# Altium schematic sheet Pointer.SchDoc
size A
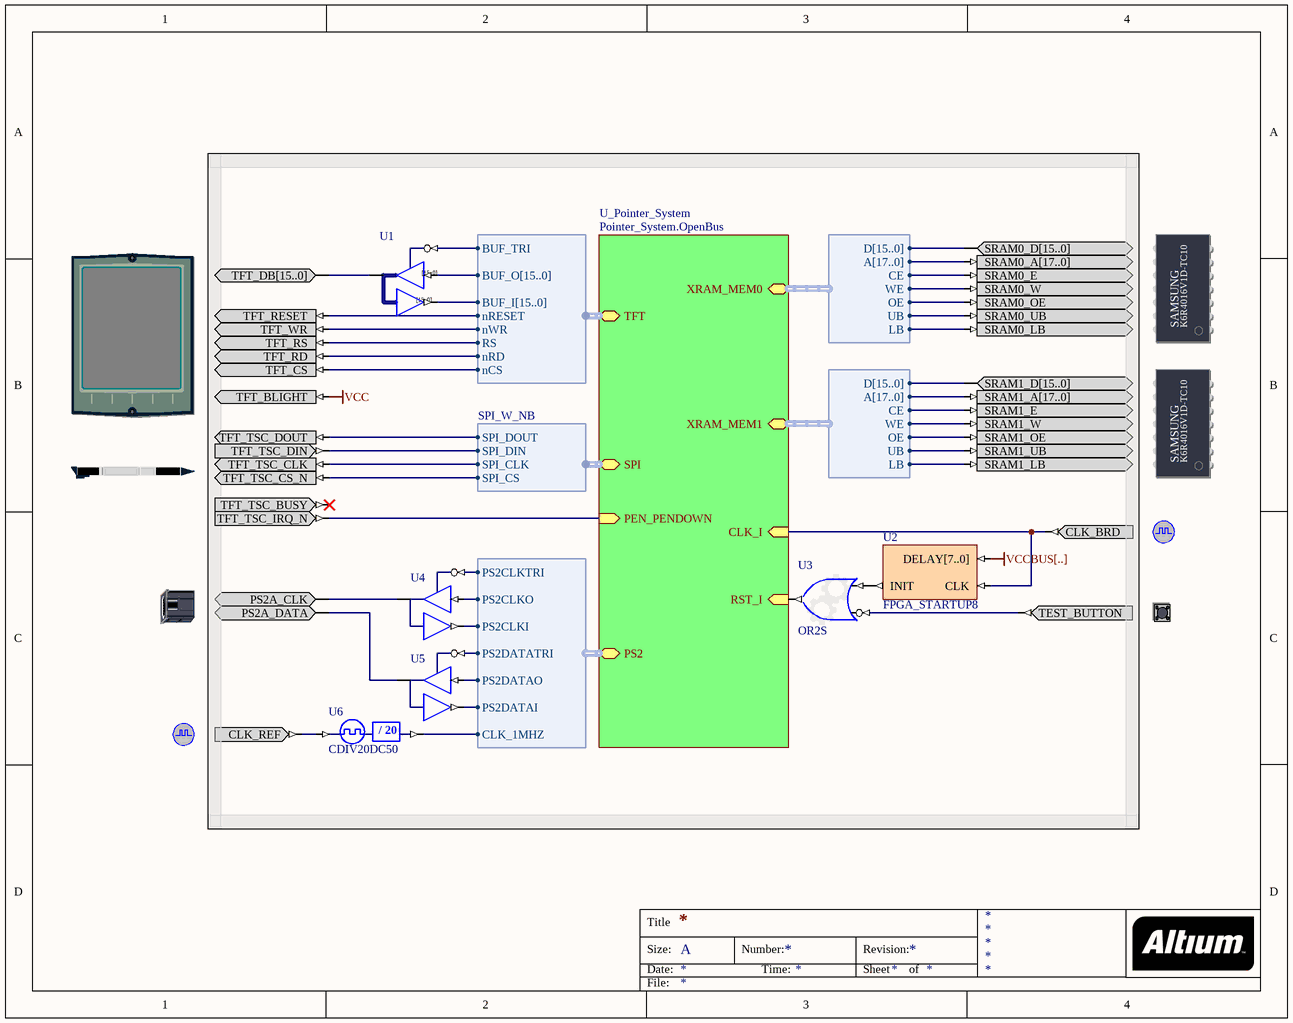
[diagram p0: Pointer.SchDoc]

## Parts
(Parts that share a designator on the sheet are numbered #1, #2 ... from top to bottom, then left to right.)
?#1  SRAM_DAUGHTER0  (value not drawn)
?#2  TFT_LCD  (value not drawn)
?#3  SRAM_DAUGHTER1  (value not drawn)
?#4  TOUCH_SCREEN_PEN  (value not drawn)
?#5  CLOCK_BOARD  (value not drawn)
?#6  PS2A  (value not drawn)
?#7  TEST_BUTTON  (value not drawn)
?#8  CLOCK_REFERENCE  (value not drawn)
U1  IOBUF16B  (value not drawn)
U2  FPGA_STARTUP8
U3  OR2S
U4  IOBUF  (value not drawn)
U5  IOBUF  (value not drawn)
U6  CDIV20DC50

## Sub-sheets
U_Pointer_System = Pointer_System.OpenBus: CLK_I (in), RST_I (in), PS2 (harness PS2_W), SPI (harness SPI_W_NB), PEN_PENDOWN (in), XRAM_MEM0 (harness WB_MEM_CTRL_SRAM16_A18), XRAM_MEM1 (harness WB_MEM_CTRL_SRAM16_A18), TFT (harness VGA32_ILI9320)

## Harnesses
WB_MEM_CTRL_SRAM16_A18: D[15..0], A[17..0], CE, WE, OE, UB, LB
PS2_W: PS2CLKTRI, PS2CLKO, PS2CLKI, PS2DATATRI, PS2DATAO, PS2DATAI, CLK_1MHZ
VGA32_ILI9320: BUF_TRI, BUF_O[15..0], BUF_I[15..0], nRESET, nWR, RS, nRD, nCS
SPI_W_NB: SPI_DOUT, SPI_DIN, SPI_CLK, SPI_CS

## Nets
VCC: ?#2.TFT_BLIGHT
VCCBUS[..]: U2.DELAY[7..0]
Net?#1_SRAM0_A[17..0]: ?#1.SRAM0_A[17..0] ; sheet U_Pointer_System/XRAM_MEM0.A[17..0]
Net?#1_SRAM0_D[15..0]: ?#1.SRAM0_D[15..0] ; sheet U_Pointer_System/XRAM_MEM0.D[15..0]
Net?#1_SRAM0_E: ?#1.SRAM0_E ; sheet U_Pointer_System/XRAM_MEM0.CE
Net?#1_SRAM0_LB: ?#1.SRAM0_LB ; sheet U_Pointer_System/XRAM_MEM0.LB
Net?#1_SRAM0_OE: ?#1.SRAM0_OE ; sheet U_Pointer_System/XRAM_MEM0.OE
Net?#1_SRAM0_UB: ?#1.SRAM0_UB ; sheet U_Pointer_System/XRAM_MEM0.UB
Net?#1_SRAM0_W: ?#1.SRAM0_W ; sheet U_Pointer_System/XRAM_MEM0.WE
Net?#2_TFT_CS: ?#2.TFT_CS ; sheet U_Pointer_System/TFT.nCS
Net?#2_TFT_DB[15..0]: ?#2.TFT_DB[15..0] U1.IO[15..0]
Net?#2_TFT_RD: ?#2.TFT_RD ; sheet U_Pointer_System/TFT.nRD
Net?#2_TFT_RESET: ?#2.TFT_RESET ; sheet U_Pointer_System/TFT.nRESET
Net?#2_TFT_RS: ?#2.TFT_RS ; sheet U_Pointer_System/TFT.RS
Net?#2_TFT_WR: ?#2.TFT_WR ; sheet U_Pointer_System/TFT.nWR
Net?#3_SRAM1_A[17..0]: ?#3.SRAM1_A[17..0] ; sheet U_Pointer_System/XRAM_MEM1.A[17..0]
Net?#3_SRAM1_D[15..0]: ?#3.SRAM1_D[15..0] ; sheet U_Pointer_System/XRAM_MEM1.D[15..0]
Net?#3_SRAM1_E: ?#3.SRAM1_E ; sheet U_Pointer_System/XRAM_MEM1.CE
Net?#3_SRAM1_LB: ?#3.SRAM1_LB ; sheet U_Pointer_System/XRAM_MEM1.LB
Net?#3_SRAM1_OE: ?#3.SRAM1_OE ; sheet U_Pointer_System/XRAM_MEM1.OE
Net?#3_SRAM1_UB: ?#3.SRAM1_UB ; sheet U_Pointer_System/XRAM_MEM1.UB
Net?#3_SRAM1_W: ?#3.SRAM1_W ; sheet U_Pointer_System/XRAM_MEM1.WE
Net?#4_TFT_TSC_CLK: ?#4.TFT_TSC_CLK ; sheet U_Pointer_System/SPI.SPI_CLK
Net?#4_TFT_TSC_CS_N: ?#4.TFT_TSC_CS_N ; sheet U_Pointer_System/SPI.SPI_CS
Net?#4_TFT_TSC_DIN: ?#4.TFT_TSC_DIN ; sheet U_Pointer_System/SPI.SPI_DIN
Net?#4_TFT_TSC_DOUT: ?#4.TFT_TSC_DOUT ; sheet U_Pointer_System/SPI.SPI_DOUT
Net?#4_TFT_TSC_IRQ_N: ?#4.TFT_TSC_IRQ_N ; sheet U_Pointer_System/PEN_PENDOWN
Net?#5_CLK_BRD: ?#5.CLK_BRD U2.CLK ; sheet U_Pointer_System/CLK_I
Net?#6_PS2A_CLK: ?#6.PS2A_CLK U4.IO
Net?#6_PS2A_DATA: ?#6.PS2A_DATA U5.IO
Net?#7_TEST_BUTTON: ?#7.TEST_BUTTON U3.I1
Net?#8_CLK_REF: ?#8.CLK_REF U6.CLKIN
NetU1_I[15..0]: U1.I[15..0] ; sheet U_Pointer_System/TFT.BUF_O[15..0]
NetU1_O[15..0]: U1.O[15..0] ; sheet U_Pointer_System/TFT.BUF_I[15..0]
NetU1_T: U1.T ; sheet U_Pointer_System/TFT.BUF_TRI
NetU2_INIT: U2.INIT U3.I0
NetU3_O: U3.O ; sheet U_Pointer_System/RST_I
NetU4_I: U4.I ; sheet U_Pointer_System/PS2.PS2CLKO
NetU4_O: U4.O ; sheet U_Pointer_System/PS2.PS2CLKI
NetU4_T: U4.T ; sheet U_Pointer_System/PS2.PS2CLKTRI
NetU5_I: U5.I ; sheet U_Pointer_System/PS2.PS2DATAO
NetU5_O: U5.O ; sheet U_Pointer_System/PS2.PS2DATAI
NetU5_T: U5.T ; sheet U_Pointer_System/PS2.PS2DATATRI
NetU6_CLKDV: U6.CLKDV ; sheet U_Pointer_System/PS2.CLK_1MHZ

Not connected (* = marked no-connect by the designer): ?#4 TFT_TSC_BUSY*

## Notes on the sheet
- Title
- Size:
- Date:
- A
- Number:
- Time:
- Revision:
- Sheet
- of
- File:
- (in symbol CDIV20DC50) / 20
- (in symbol IOBUF16B) [15..0]
- (in symbol SRAM_DAUGHTER0) SAMSUNG; K6R4016V1D-TC10
- (in symbol SRAM_DAUGHTER1) SAMSUNG; K6R4016V1D-TC10

## Library data of the parts
?#1 = SRAM_DAUGHTER0: Free Static RAM - Daughterboard; PortComponent: True; Published: 14-May-2007; Publisher: Altium Limited; HelpURL: TR0149 Technical Reference for Altium's Xilinx Spartan-3 Daughter Board DB30.pdf#page=16
?#2 = TFT_LCD: TFT LCD Panel; PortComponent: True; Published: 22-Jan-2007; Publisher: Altium Limited; HelpURL: https://wiki.altium.com/display/ADOH/NanoBoard+3000+-+TFT+LCD+Panel+%28with+Touch+Screen%29
?#3 = SRAM_DAUGHTER1: Free Static RAM - Daughterboard; PortComponent: True; Published: 14-May-2007; Publisher: Altium Limited; HelpURL: TR0149 Technical Reference for Altium's Xilinx Spartan-3 Daughter Board DB30.pdf#page=16
?#4 = TFT_PEN: Touch Screen Pen Control; PortComponent: True; Published: 22-Jan-2007; Publisher: Altium Limited; HelpURL: https://wiki.altium.com/display/ADOH/NanoBoard+3000+-+TFT+LCD+Panel+%28with+Touch+Screen%29
?#5 = CLOCK_BOARD: Global System Clock Supply; PortComponent: True; Published: 19-Nov-2003; Publisher: Altium Limited; HelpURL: TR0143 Technical Reference Manual for Altium's Desktop NanoBoard NB2DSK01.pdf#page=41; UseInDSF: True
?#6 = PS2A: Mouse PS2 Connector; PortComponent: True; Published: 19-Nov-2003; Publisher: Altium Limited; HelpURL: TR0143 Technical Reference Manual for Altium's Desktop NanoBoard NB2DSK01.pdf#page=46
?#7 = TEST_BUTTON: Test / Reset Button; PortComponent: True; Published: 19-Nov-2003; Publisher: Altium Limited; HelpURL: TR0143 Technical Reference Manual for Altium's Desktop NanoBoard NB2DSK01.pdf#page=53
?#8 = CLOCK_REFERENCE: Global System Clock Reference Supply; PortComponent: True; Published: 19-Nov-2003; Publisher: Altium Limited; HelpURL: TR0143 Technical Reference Manual for Altium's Desktop NanoBoard NB2DSK01.pdf#page=41
U1 = IOBUF16B: 16-Bit Input/Output Buffer, Bus Version; SubClass: IOBUF; Enable: Low; Control: Common Control T; PortSize: 16; ArchiveName: GENERIC; VHDLIB_SIM: GENERIC_LIB; Published: 29-Jan-2004; Publisher: Altium Limited; LastRevisionNo: 1.00.00; HelpURL: CR0118 FPGA Generic Library Guide.pdf#page=293; ComponentLink1URL: CR0125 FPGA Buffer Resource Usage.pdf#page=91; ComponentLink1Description: Core &Resource Usage; FunctionalClass: Buffer; PortStyle: Bus Version
U2 = FPGA_STARTUP8: FPGA Startup With 8 Bit Delay; Published: 9-Dec-2004; Publisher: Altium Limited; HelpURL: CR0119 FPGA_STARTUPx Powerup Delay Unit.pdf; LastRevisionNo: 1.00.00; ComponentLink1Description: Core &Resource Usage; ComponentLink1URL: CR0139 FPGA Peripheral Resource Usage.pdf#page=11
U3 = GATE: Configurable Generic Gate; ConfiguratorName: GENERIC_GATE; ConfigurationParameters: {}Version[1.0]{}GateKind[OR]{}BusInput[False]{}GateInputType[Bit]{}GateOutputOption[Normal]{}BusWidth[8]{}RegisterOutputs[False]{}NegativeClockEdge[False]{}InputCount[2]{}InputInvert0[False]{}InputInvert1[True]{}; LastRevisionNo: 1.00.00; Published: 3-Sep-2008; Publisher: Altium Limited
U4 U5 = IOBUF: Input/Output Buffer; Enable: Low; Control: Common Control T; ArchiveName: GENERIC; VHDLIB_SIM: GENERIC_LIB; Published: 29-Jan-2004; Publisher: Altium Limited; XilinxEquivalent: IOBUF; LastRevisionNo: 1.00.00; HelpURL: CR0118 FPGA Generic Library Guide.pdf#page=293; ComponentLink1URL: CR0125 FPGA Buffer Resource Usage.pdf#page=78; ComponentLink1Description: Core &Resource Usage; FunctionalClass: Buffer; SubClass: IOBUF
U6 = CDIV20DC50: Clock Divider by 20 with 50% Duty Cycle Output; DivisorRate: 20; DutyCycle: 50; ArchiveName: GENERIC; VHDLIB_SIM: GENERIC_LIB; Published: 29-Jan-2004; Publisher: Altium Limited; LastRevisionNo: 1.00.00; HelpURL: CR0118 FPGA Generic Library Guide.pdf#page=143; ComponentLink1URL: CR0127 FPGA Clock Divider Resource Usage.pdf#page=21; ComponentLink1Description: Core &Resource Usage; FunctionalClass: Clock Divider